# EAGLE design pierce-test-board-2 (EAGLE 6.5.0)
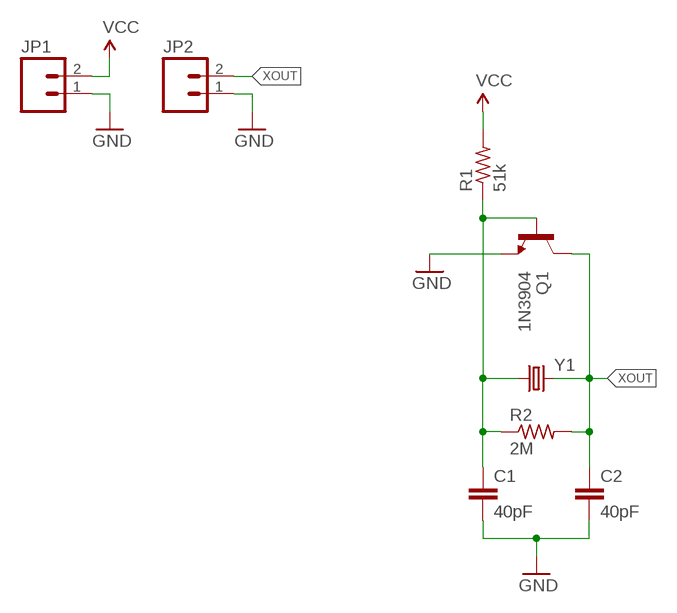
[diagram p0: schematic, sheet 1]

## Parts
C1  40pF  CAPACITOR-CERAMIC025-024X044  [C025-024X044]
C2  40pF  CAPACITOR-CERAMIC025-024X044  [C025-024X044]
JP1  M02PTH  [1X02]
JP2  M02PTH  [1X02]
Q1  1N3904  TRANSISTOR_NPNTO-92-AMMO-EBC  [TO-92-AMMO]
R1  51k  RESISTORAXIAL-PTH-7.68MM  [RESISTOR-AXIAL-PTH-7.68MM]
R2  2M  RESISTORAXIAL-PTH-7.68MM  [RESISTOR-AXIAL-PTH-7.68MM]
Y1  CRYSTALHC49UV  [HC49U-V]

## Nets
GND: C1.2 C2.2 JP1.1 JP2.1 Q1.1(E)
N$4: C1.1 Q1.2(B) R1.P$1 R2.P$1 Y1.1
VCC: JP1.2 R1.P$2
XOUT: C2.1 JP2.2 Q1.3(C) R2.P$2 Y1.2

## Library data of the parts
C1 C2 = A_butts:CAPACITOR-CERAMIC: CAPACITOR, European symbol
JP1 JP2 = A_butts:M02: Standard 2-pin 0.1" header. Use with - straight break away headers ( PRT-00116) - right angle break away headers (PRT-00553) - swiss pins (PRT-00743) - machine pins (PRT-00117) - female headers (PRT-00115) Molex polarized connector foot print use with: PRT-08233 with associated crimp pins and housings. 2.54_SCREWTERM for use with PRT-10571. 3.5mm Screw Terminal footprints for PRT-08084 5mm Screw Terminal footprints for use with PRT-08433
Q1 = A_butts:TRANSISTOR_NPN: Generic NPN BJT MMBT2222A - TRANS-08049 (SOT-23, 1A 40V) MPSA42 - TRANS-09116 (SOT-23, 500mA 300V) MMBT5088LT1G - TRANS-11160 (SOT-23, 50 mA 30V) BC547 - COM-08928 <http://www.sparkfun.com/products/8928> (TO-92 45V 100mA) (1.Collector 2.Base 3.Emitter) 2N3904 - COM-00521 <http://www.sparkfun.com/products/521> (TO-92 40V 200mA) (1.Emitter 2.Base 3.Collector) P2N2222A - COM-12852 <http://www.sparkfun.com/products/12852> (TO-92 40V 600mA) (1.Collector 2.Base 3.Emitter)
R1 R2 = A_butts:RESISTOR: RESISTOR, American symbol
Y1 = A_butts:CRYSTAL: Various standard crystals. Proven footprints. Spark Fun Electronics SKU : COM-00534

## Board
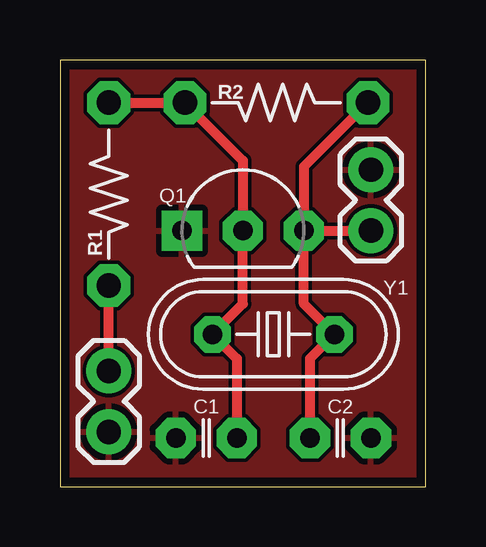
[diagram p1: board, top side]
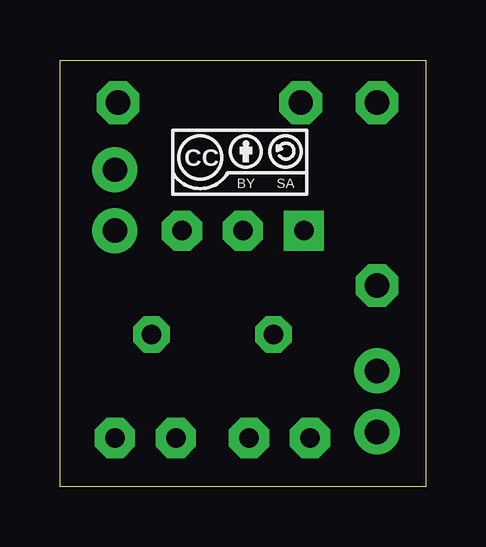
[diagram p2: board, bottom side, seen from below]

Size 15.24 x 17.78 mm. Coordinates in mm from the lower left corner, seen from the top.
Outline: 0,0 15.24,0 15.24,17.78 0,17.78 0,0
Copper layers (1*16): Top 0.0356mm / dielectric 1.5011mm / Bottom 0.0356mm
Design rules "LaenPCBOrder_2": minimum track width 6mil, minimum drill 13mil, track to track 6mil, track to pad 6mil, pad to pad 6mil, via to via 6mil, smd to smd 6mil, copper to edge 15mil, drill to drill 6mil, minimum pad ring 7mil, minimum via ring 7mil, stop-mask expansion 3mil, vias tented up to drill 20mil, thermal gap 10mil

### Footprints (pad centres in the part's own frame; a part is rotated, then mirrored left to right if it is on the bottom)
C025-024X044 = drill 0.813 pad 1.676 octagon: 1 -1.27,0; 2 1.27,0
1X02 = drill 1.016 pad 1.88: 1 0,0; 2 2.54,0
TO-92-AMMO = drill 0.813 pad 1.676 square: 1 -2.54,0 | drill 0.813 pad 1.676 octagon: 2 0,0; 3 2.54,0
RESISTOR-AXIAL-PTH-7.68MM = drill 1.016 pad 1.778 octagon: P$1 -3.81,0; P$2 3.81,0
HC49U-V = drill 0.813 pad 1.524 octagon: 1 -2.54,0; 2 2.54,0

### Placement (x,y rotation side)
C1  6.1,2.03 180 top
C2  11.68,2.03 0 top
JP1  2.03,2.29 90 top
JP2  12.95,13.21 270 top
Q1  7.62,10.67 0 top
R1  2.03,12.19 270 top
R2  9.02,16 0 top
U$1  [CC-BY-SA-4.0-NO-URL]  9.4,13.72 0 bottom
Y1  8.89,6.35 0 top

### Tracks (layer width: path | path; a pad name or v marks a point on that pad's centre or on a via)
GND
  pour Top: 0,0 0,17.78 15.24,17.78 15.24,0
N$4
  Top 0.406: R1.P$1 R2.P$1 7.62,13.59 Q1.2 7.62,7.62 Y1.1 7.37,5.33 C1.1
VCC
  Top 0.406: JP1.2 R1.P$2
XOUT
  Top 0.406: Q1.3 JP2.2 | R2.P$2 10.16,13.34 Q1.3 | Q1.3 10.16,7.62 Y1.2 10.41,5.33 C2.1